# EAGLE schematic fancontroller (EAGLE 7.7.0)
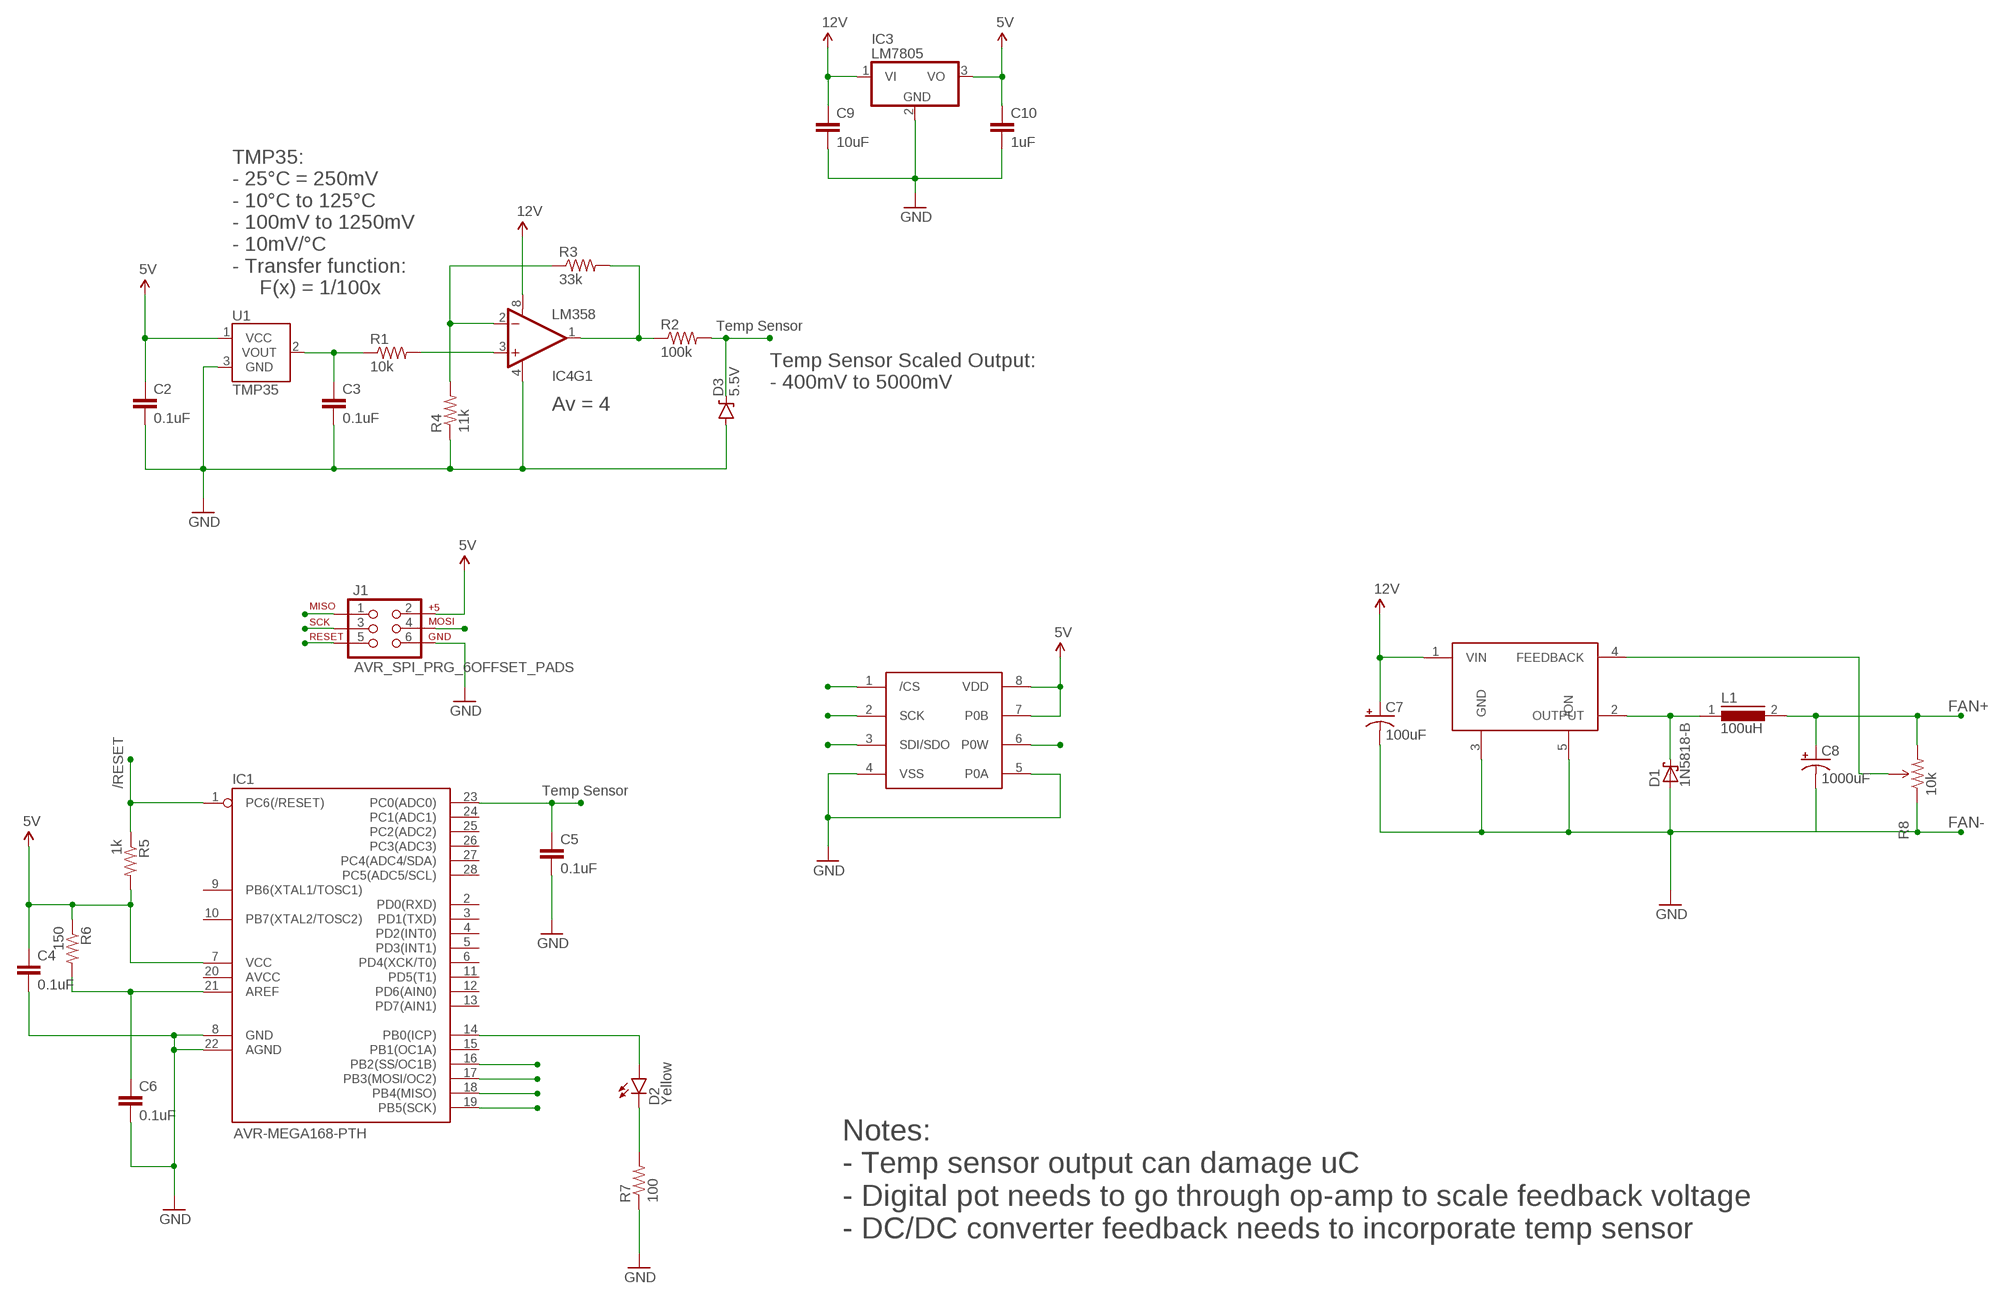
[diagram p0: schematic, sheet 1]

## Parts
C2  0.1uF  CAPPTH  [CAP-PTH-SMALL]
C3  0.1uF  CAPPTH  [CAP-PTH-SMALL]
C4  0.1uF  CAPPTH  [CAP-PTH-SMALL]
C5  0.1uF  CAPPTH  [CAP-PTH-SMALL]
C6  0.1uF  CAPPTH  [CAP-PTH-SMALL]
C7  100uF  CAP_POLPTH1  [CPOL-RADIAL-100UF-25V]
C8  1000uF  CAP_POLPTH1  [CPOL-RADIAL-100UF-25V]
C9  10uF  CAPPTH  [CAP-PTH-SMALL]
C10  1uF  CAPPTH  [CAP-PTH-SMALL]
D1  1N5818-B  [DO41-7.6]
D2  Yellow  LED5MM  [LED5MM]
D3  5.5V  DIODE-ZENERPTH  [DIODE-ZENER]
IC1  AVR-MEGA168-PTH  AVR-MEGA8-PPTH  [DIL28-3]
IC3  LM7805  7812TV  [TO220V]
IC4  LM358  LM358KIT  [DIP08-KIT]
J1  AVR_SPI_PRG_6OFFSET_PADS  [2X3_OFFSET]
L1  100uH  A26GFC  [A26GFC]
R1  10k  10KOHM-1/4W-1%(PTH)VERT  [AXIAL-0.1]
R2  100k  10KOHM-1/4W-1%(PTH)VERT  [AXIAL-0.1]
R3  33k  10KOHM-1/4W-1%(PTH)VERT  [AXIAL-0.1]
R4  11k  10KOHM-1/4W-1%(PTH)VERT  [AXIAL-0.1]
R5  1k  10KOHM-1/4W-1%(PTH)VERT  [AXIAL-0.1]
R6  150  10KOHM-1/4W-1%(PTH)VERT  [AXIAL-0.1]
R7  100  10KOHM-1/4W-1%(PTH)VERT  [AXIAL-0.1]
R8  10k  TRIMPOTPTH  [TRIM_POT_PTH]
U1  TMP35  TMP36GT9  [TO-92]
U$1  LM2576XXVERTICAL  [TO-220-5]
U$3  MCP4131-103  MCP41X1  [PDIP-8]

## Nets
5V: C2.1 C4.1 C10.1 IC1.7(VCC) IC3.3(VO) J1.2 R5.P$2 R6.P$1 U1.1(VCC) U$3.7(P0B) U$3.8(VDD)
12V: C7.1(+) C9.1 IC3.1(VI) IC4.8(V+) U$1.1(VIN)
/RESET: IC1.1(PC6(/RESET)) J1.5 R5.P$1
/SS: IC1.16(PB2(SS/OC1B)) U$3.1(/CS)
GND: C2.2 C3.2 C4.2 C5.2 C6.2 C7.2(-) C8.2(-) C9.2 C10.2 D1.A D3.P$2(A) IC1.8(GND) IC1.22(AGND) IC3.2(GND) IC4.4(V-) J1.6 R4.P$1 R7.P$1 R8.1(CCW) U1.3(GND) U$1.3(GND) U$1.5(/ON) U$3.4(VSS) U$3.5(P0A)
MISO: IC1.18(PB4(MISO)) J1.1
MOSI: IC1.17(PB3(MOSI/OC2)) J1.4 U$3.3(SDI/SDO)
N$1: C8.1(+) L1.2 R8.3(CW)
N$2: D2.A IC1.14(PB0(ICP))
N$3: D1.C L1.1 U$1.2(OUTPUT)
N$4: R8.2(WIPER) U$1.4(FEEDBACK)
N$5: D2.K(C) R7.P$2
N$6: IC4.1(OUT) R2.P$1 R3.P$2
N$7: IC4.2(-IN) R3.P$1 R4.P$2
N$8: IC4.3(+IN) R1.P$2
N$9: C6.1 IC1.21(AREF) R6.P$2
N$11: C3.1 R1.P$1 U1.2(VOUT)
POT_P0W: U$3.6(P0W)
SCK: IC1.19(PB5(SCK)) J1.3 U$3.2(SCK)
TEMP_SENSOR: C5.1 D3.P$1(C) IC1.23(PC0(ADC0)) R2.P$2
Unconnected: IC1.2(PD0(RXD)) IC1.3(PD1(TXD)) IC1.4(PD2(INT0)) IC1.5(PD3(INT1)) IC1.6(PD4(XCK/T0)) IC1.9(PB6(XTAL1/TOSC1)) IC1.10(PB7(XTAL2/TOSC2)) IC1.11(PD5(T1)) IC1.12(PD6(AIN0)) IC1.13(PD7(AIN1)) IC1.15(PB1(OC1A)) IC1.20(AVCC) IC1.24(PC1(ADC1)) IC1.25(PC2(ADC2)) IC1.26(PC3(ADC3)) IC1.27(PC4(ADC4/SDA)) IC1.28(PC5(ADC5/SCL)) IC4.5(+IN) IC4.6(-IN) IC4.7(OUT)

## Notes on the sheet
- TMP35:
  - 25°C = 250mV
  - 10°C to 125°C
  - 100mV to 1250mV
  - 10mV/°C
  - Transfer function:
       F(x) = 1/100x
- Temp Sensor
- Av = 4
- Temp Sensor Scaled Output:
  - 400mV to 5000mV
- FAN+
- /RESET
- Temp Sensor
- FAN-
- Notes:
  - Temp sensor output can damage uC
  - Digital pot needs to go through op-amp to scale feedback voltage
  - DC/DC converter feedback needs to incorporate temp sensor

## Library data of the parts
C2-C6 C9 C10 = SparkFun-Capacitors:CAP: Capacitor Standard 0603 ceramic capacitor, and 0.1" leaded capacitor.
C7 C8 = SparkFun-Capacitors:CAP_POL: Capacitor Polarized These are standard SMD and PTH capacitors. Normally 10uF, 47uF, and 100uF in electrolytic and tantalum varieties. Always verify the external diameter of the through hole cap, it varies with capacity, voltage, and manufacturer. The EIA devices should be standard.
D1 = diode:1N581*: 1.0A SCHOTTKY BARRIER RECTIFIER Source: http://www.diodes.com/datasheets/ds23001.pdf
D2 = SparkFun-LED:LED: LEDs Standard schematic elements and footprints for 5mm, 3mm, 1206, and 0603 sized LEDs. 5mm - Spark Fun Electronics SKU : COM-00529 (and others)
D3 = SparkFun-DiscreteSemi:DIODE-ZENER: Zener Diode Production Part - 8199 3.4V Zener Voltage
IC1 = SparkFun-DigitalIC:AVR-MEGA8-P: MICROCONTROLLER 8 Kbytes FLASH 1 kbytes SRAM 512 bytes EEPROM USART 4-channel 10 bit ADC 2-channel 8 bit ADC
IC3 = linear:78*: Positive VOLTAGE REGULATOR Source: http://cache.national.com/ds/LM/LM78L05.pdf http://www.fairchildsemi.com/ds/LM/LM7805.pdf
IC4 = SparkFun-AnalogIC:LM358: Jellybean op-amp; PROD_ID: IC-09172
J1 = SparkFun-Connectors:AVR_SPI_PRG_6: AVR ISP 6 Pin This is the reduced ISP connector for AVR programming. Common on Arduino. This footprint will take up less PCB space and can be used with a 10-pin to 6-pin adapter such as SKU: BOB-08508 **Special note about "TEST_POINT" package. The stop mask is on the top side, so if you want your programming test points to be on the bottom of your board, make sure to place this package on the bottom side of the board. This also ensure that the orientation to program from the bottom side will be correct.
L1 = inductors:A26GFC: INDUCTOR
R1 = SparkFun-Resistors:10KOHM-1/4W-1%(PTH): RES-12183; PROD_ID: RES-12183
R2-R7 = SparkFun-Resistors:10KOHM-1/4W-1%(PTH): RES-12183; PROD_ID: RES-12183; VALUE: 10k
R8 = SparkFun-Electromechanical:TRIMPOT: Various small potentiometers for "set-and-forget" applications
U1 = SparkFun-Sensors:TMP36: Precision degC temp sensor, analog out
U$1 = Synapseware:LM2576XX
U$3 = Synapseware:MCP41X1: The MCP41XX and MCP42XX devices offer a wide range of product offerings using an SPI interface. This family of devices support 7-bit and 8-bit resistor networks, and Potentiometer and Rheostat pinouts.